# EAGLE design stamp-fixed-mk3 (EAGLE 6.5.0)
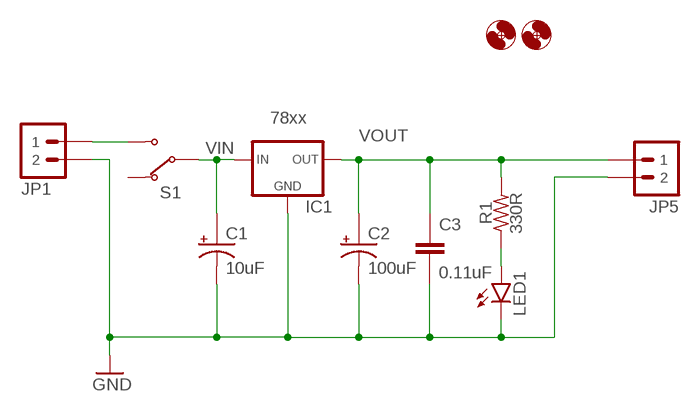
[diagram p0: schematic, sheet 1]

## Parts
C1  10uF  CAPACITOR-POLARIZEDE2.5-6  [E2,5-6]
C2  100uF  CAPACITOR-POLARIZEDE2.5-6  [E2,5-6]
C3  0.11uF  CAPACITOR-CERAMIC025-024X044  [C025-024X044]
H1  HOLE#2  [HOLE-#2]
H2  HOLE#2  [HOLE-#2]
IC1  78xx  V_REG_78XXTO-220-THERM  [TO-220-SIDE-THERM]
JP1  M02JST-PTH-RA-SMALLPADS  [JST-2-PH-RA-PTH-SMALLPADS]
JP5  M02JST-PTH-RA-SMALLPADS  [JST-2-PH-RA-PTH-SMALLPADS]
LED1  LED3MM  [LED3MM]
R1  330R  RESISTORPTH-AXIAL-5.08MM  [RESISTOR-AXIAL-PTH-5.08MM]
S1  SWITCH-SPDTPTH-VERT-2.54MM  [SWITCH-SPDT]

## Nets
GND: C1.- C2.- C3.2 IC1.GND IC1.GND@1(GND) IC1.GND@2(GND) IC1.GND@3(GND) IC1.GND@4(GND) IC1.GND@5(GND) IC1.GND@6(GND) IC1.GND@7(GND) IC1.GND@8(GND) IC1.GND@9(GND) IC1.GND@10(GND) IC1.GND@11(GND) IC1.GND@12(GND) IC1.GND@13(GND) IC1.GND@14(GND) IC1.GND@15(GND) IC1.GND@16(GND) IC1.GND@17(GND) IC1.GND@18(GND) IC1.GND@19(GND) IC1.GND@20(GND) IC1.GND@21(GND) IC1.GND@22(GND) IC1.GND@23(GND) IC1.GND@24(GND) IC1.GND@25(GND) IC1.GND@26(GND) IC1.GND@27(GND) JP1.2 JP5.2 LED1.K(C)
N$1: LED1.A R1.P$1
N$2: JP1.1 S1.3(NO)
VIN: C1.+ IC1.IN S1.2(COM)
VOUT: C2.+ C3.1 IC1.OUT JP5.1 R1.P$2
Unconnected: S1.1(NC)

## Library data of the parts
C1 C2 = A_butts:CAPACITOR-POLARIZED: POLARIZED CAPACITOR, American symbol
C3 = A_butts:CAPACITOR-CERAMIC: CAPACITOR, European symbol
H1 H2 = A_butts:HOLE: MOUNTING HOLE with drill center marker
IC1 = A_butts:V_REG_78XX: Voltage Regulator Standard 7805 5V regulator. IGO (Input Ground Output). Spark Fun Electronics SKU : COM-00107
JP1 JP5 = A_butts:M02: Standard 2-pin 0.1" header. Use with - straight break away headers ( PRT-00116) - right angle break away headers (PRT-00553) - swiss pins (PRT-00743) - machine pins (PRT-00117) - female headers (PRT-00115) Molex polarized connector foot print use with: PRT-08233 with associated crimp pins and housings. 2.54_SCREWTERM for use with PRT-10571. 3.5mm Screw Terminal footprints for PRT-08084 5mm Screw Terminal footprints for use with PRT-08433
LED1 = A_butts:LED: LEDs Standard schematic elements and footprints for 5mm, 3mm, 1206, and 0603 sized LEDs. 5mm - Spark Fun Electronics SKU : COM-00529 (and others)
R1 = A_butts:RESISTOR: RESISTOR, American symbol
S1 = A_butts:SWITCH-SPDT

## Board
Postage Stamp Power Supply Small linear power supply with flexible layout.
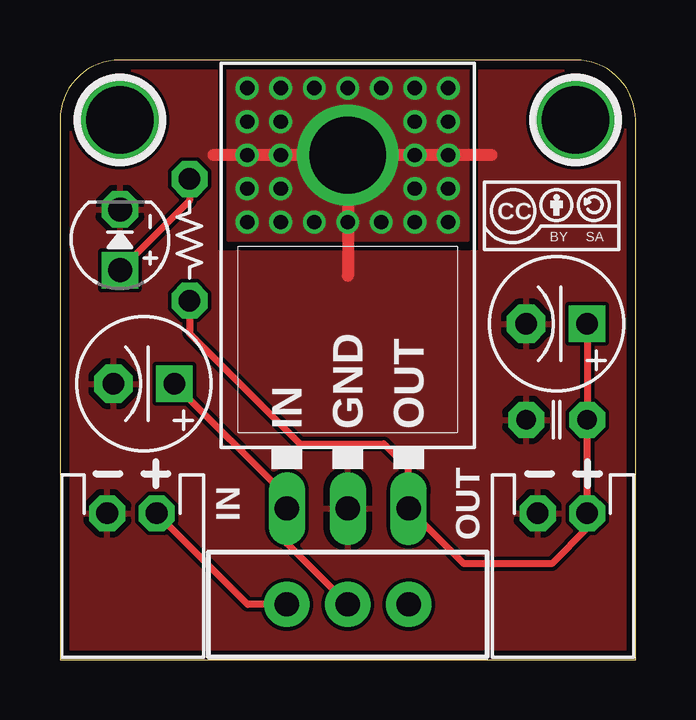
[diagram p1: board, top side]
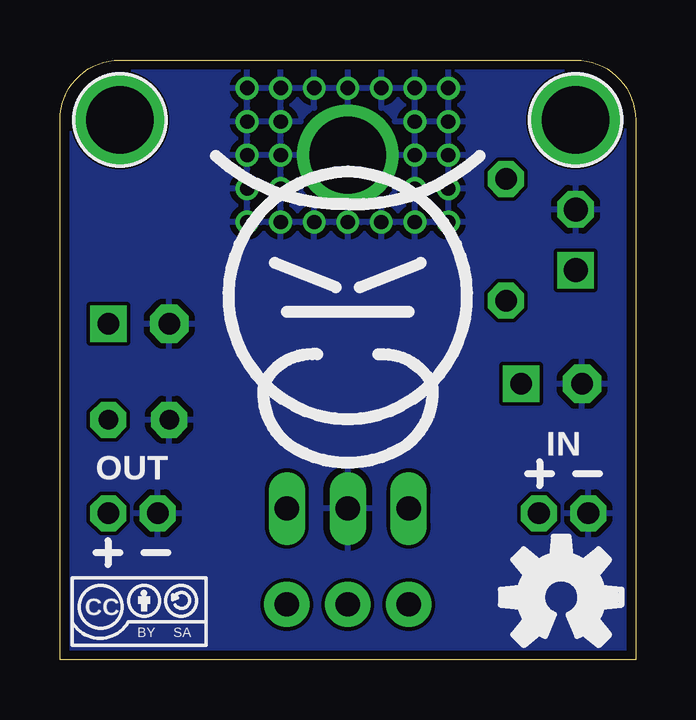
[diagram p2: board, bottom side, seen from below]

Size 24 x 25 mm. Coordinates in mm from the lower left corner, seen from the top.
Outline: 0,0 24,0 24,22.5 arc90 21.5,25 2.5,25 arc90 0,22.5 0,0
Copper layers (1*16): Top 0.0356mm / dielectric 1.5011mm / Bottom 0.0356mm
Design rules "LaenPCBOrder *": minimum track width 6mil, minimum drill 13mil, track to track 6mil, track to pad 6mil, pad to pad 6mil, via to via 6mil, smd to smd 6mil, copper to edge 15mil, drill to drill 6mil, minimum pad ring 7mil, minimum via ring 7mil, stop-mask expansion 3mil, vias tented up to drill 20mil, thermal gap 10mil

### Footprints (pad centres in the part's own frame; a part is rotated, then mirrored left to right if it is on the bottom)
E2,5-6 = drill 0.9 pad 1.524 square: + -1.27,0 | drill 0.9 pad 1.6 octagon: - 1.27,0
C025-024X044 = drill 0.813 pad 1.5 octagon: 1 -1.27,0; 2 1.27,0
HOLE-#2 = drill 2.8 pad 3.81: P$1 0,0
TO-220-SIDE-THERM = drill 1.016 long: GND 0,0; IN -2.54,0; OUT 2.54,0 | drill 3.2: GND@1 0,14.732 | drill 0.6: GND@2 -4.191,13.335; GND@3 2.794,11.938; GND@4 -4.191,11.938; GND@5 -1.397,11.938; GND@6 1.397,11.938; GND@7 -2.794,11.938; GND@8 0,11.938; GND@9 -2.794,13.335; GND@10 -4.191,14.732; GND@11 -2.794,14.732; GND@12 -4.191,16.129; GND@13 -2.794,16.129; GND@14 4.191,11.938; GND@15 2.794,13.335; GND@16 4.191,13.335; GND@17 2.794,14.732; GND@18 4.191,14.732; GND@19 2.794,16.129; GND@20 4.191,16.129; GND@21 -4.191,17.526; GND@22 -2.794,17.526; GND@23 2.794,17.526; GND@24 4.191,17.526; GND@25 -1.397,17.526; GND@26 1.397,17.526; GND@27 0,17.526
JST-2-PH-RA-PTH-SMALLPADS = drill 0.9 pad 1.5 octagon: 1 -1.03,0; 2 1.03,0
LED3MM = drill 1 pad 1.524 square: A -1.27,0 | drill 1 pad 1.524 octagon: K 1.27,0
RESISTOR-AXIAL-PTH-5.08MM = drill 0.9 pad 1.5 octagon: P$1 -2.54,0; P$2 2.54,0
SWITCH-SPDT = drill 1.016 pad 1.88: 1 0,2.54; 2 0,0; 3 0,-2.54

### Placement (x,y rotation side)
C1  3.5,11.5 180 top
C2  20.71,14 180 top
C3  20.71,10 180 top
H1  2.5,22.5 0 top
H2  21.5,22.5 0 top
IC1  12,6.3 0 top
JP1  3,6.1 180 top
JP5  20.95,6.1 180 top
LED1  2.5,17.5 90 top
R1  5.4,17.5 270 top
S1  12,2.3 270 top
U$1  [OSHWLOGO_SILKONLY]  3.1,2.6 0 bottom
U$2  [COW]  12,14 0 bottom
U$3  [CC-BY-SA-4.0-NO-URL]  20.5,18.5 0 top
U$4  [CC-BY-SA-4.0-NO-URL]  20.7,2 0 bottom

### Tracks (layer width: path | path; a pad name or v marks a point on that pad's centre or on a via)
GND
  Top 0.5: 18,21.03 IC1.GND@18 IC1.GND@1 | IC1.GND@1 6.4,21.03 | IC1.GND@1 12,16
  pour Top: 0,0 0,22.5 arc-90 2.5,25 6.5,25 6.5,17 17.5,17 17.5,25 21.5,25 arc-90 24,22.5 24,0
  pour Top (no thermals): 7,17.5 17,17.5 17,25 7,25
  pour Bottom: 0,0 0,22.5 arc-90 2.5,25 21.5,25 arc-90 24,22.5 24,0
N$1
  Top 0.3: R1.P$1 5.4,19.13 LED1.A
N$2
  Top 0.3: S1.3 7.83,2.3 JP1.1
VIN
  Top 0.3: S1.2 9.46,4.84 IC1.IN 9.46,6.81 C1.+
VOUT
  Top 0.3: R1.P$2 5.4,13.6 10,9 13.5,9 14.5,8 14.5,6.34 IC1.OUT 16.84,4 20.5,4 21.98,5.48 JP5.1 C3.1 C2.+

### Text on the board
tPlace: IN | OUT
bPlace: IN | OUT